# Altium project PowerBord.PrjPCB
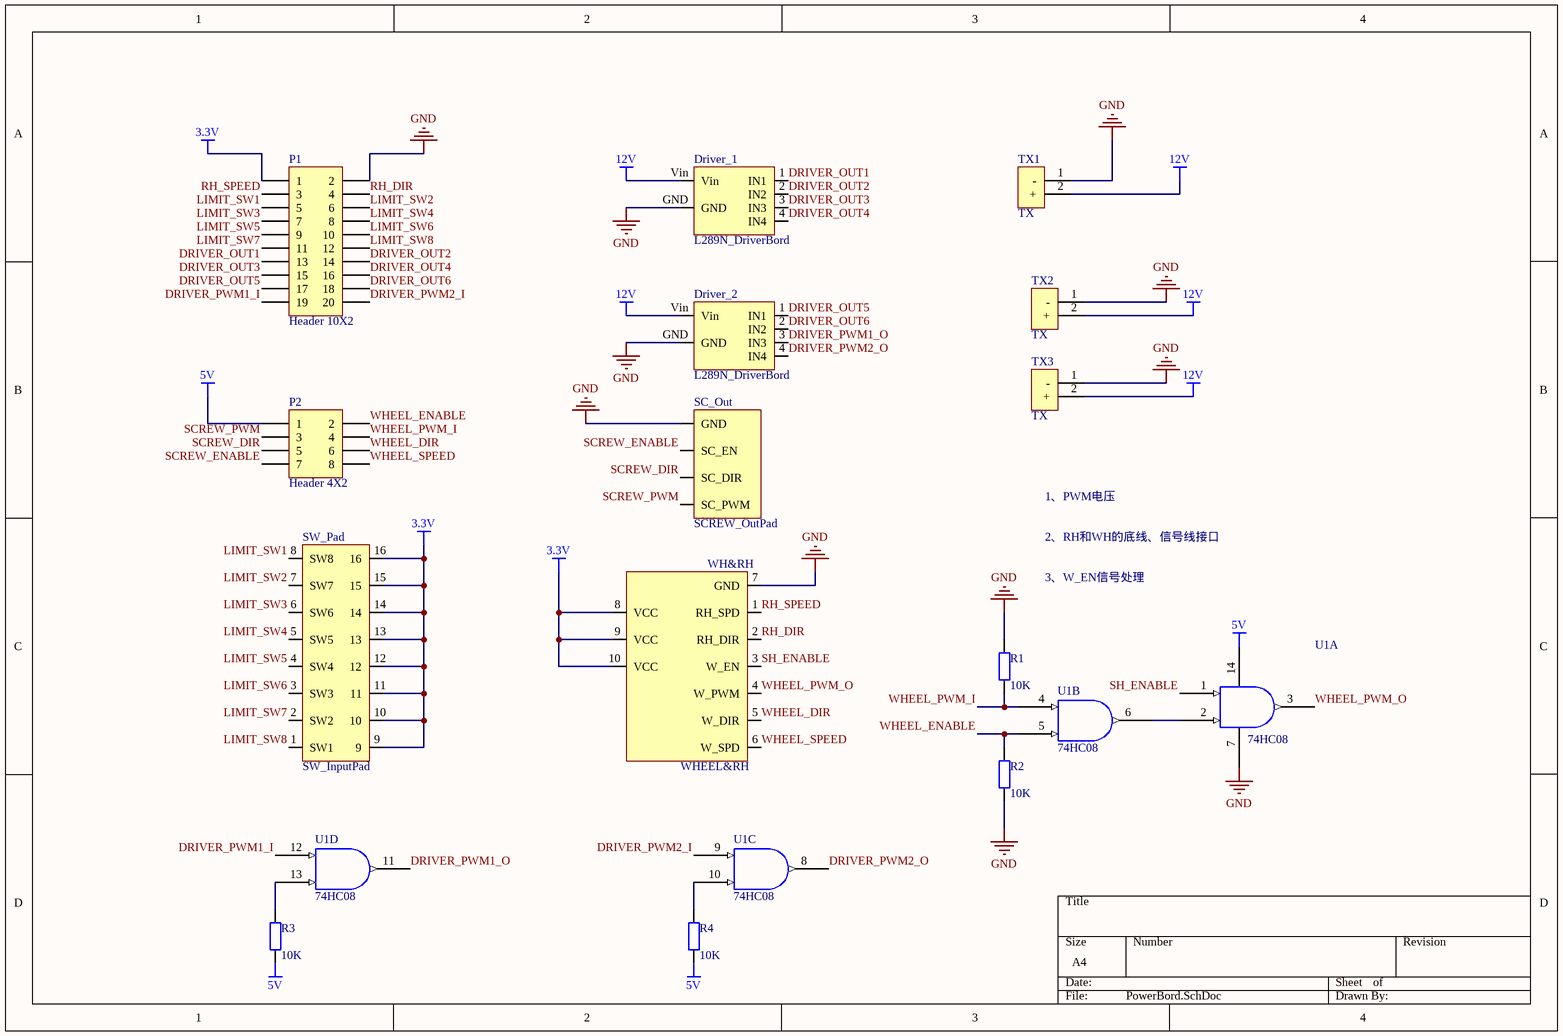
[diagram p0: PowerBord.SchDoc]
1 sheet, 15 parts. Net scope: global (net labels, ports and power ports of the same name join across sheets).
Board file: PowerBord.PcbDoc

## Sheet PowerBord.SchDoc
size A4

### Parts
Driver_1  L289N_DriverBord  [L298N_DB]
Driver_2  L289N_DriverBord  [L298N_DB]
P1  Header 10X2  [JTAG20]
P2  Header 4X2  [HDR2X4]
R1  10K  [R 0805_M]
R2  10K  [R 0805_M]
R3  10K  [R 0805_M]
R4  10K  [R 0805_M]
SC_Out  SCREW_OutPad  [SC_OutPad]
SW_Pad  SW_InputPad  [SW_InputPad]
TX1  TX  [TX]
TX2  TX  [TX]
TX3  TX  [TX]
U1  74HC08  [SOP-14]  (parts A,B,C,D of 4)
WH&RH  WHEEL&RH  [WHEEL&RH]

### Nets
3.3V: P1.1 SW_Pad.9 SW_Pad.10 SW_Pad.11 SW_Pad.12 SW_Pad.13 SW_Pad.14 SW_Pad.15 SW_Pad.16 WH&RH.8(VCC) WH&RH.9(VCC) WH&RH.10(VCC)
5V: P2.1 R3.1 R4.1 U1.14(VCC)
12V: Driver_1.Vin Driver_2.Vin TX1.2(+) TX2.2(+) TX3.2(+)
GND: Driver_1.GND Driver_2.GND P1.2 R1.2 R2.1 SC_Out.4(GND) TX1.1(-) TX2.1(-) TX3.1(-) U1.7(GND) WH&RH.7(GND)
DRIVER_OUT1: Driver_1.1(IN1) P1.13
DRIVER_OUT2: Driver_1.2(IN2) P1.14
DRIVER_OUT3: Driver_1.3(IN3) P1.15
DRIVER_OUT4: Driver_1.4(IN4) P1.16
DRIVER_OUT5: Driver_2.1(IN1) P1.17
DRIVER_OUT6: Driver_2.2(IN2) P1.18
DRIVER_PWM1_I: P1.19 U1.12
DRIVER_PWM1_O: Driver_2.3(IN3) U1.11
DRIVER_PWM2_I: P1.20 U1.9
DRIVER_PWM2_O: Driver_2.4(IN4) U1.8
LIMIT_SW1: P1.5 SW_Pad.8(SW8)
LIMIT_SW2: P1.6 SW_Pad.7(SW7)
LIMIT_SW3: P1.7 SW_Pad.6(SW6)
LIMIT_SW4: P1.8 SW_Pad.5(SW5)
LIMIT_SW5: P1.9 SW_Pad.4(SW4)
LIMIT_SW6: P1.10 SW_Pad.3(SW3)
LIMIT_SW7: P1.11 SW_Pad.2(SW2)
LIMIT_SW8: P1.12 SW_Pad.1(SW1)
RH_DIR: P1.4 WH&RH.2(RH_DIR)
RH_SPEED: P1.3 WH&RH.1(RH_SPD)
SCREW_DIR: P2.5 SC_Out.2(SC_DIR)
SCREW_ENABLE: P2.7 SC_Out.3(SC_EN)
SCREW_PWM: P2.3 SC_Out.1(SC_PWM)
SH_ENABLE: U1.1 WH&RH.3(W_EN)
WHEEL_DIR: P2.6 WH&RH.5(W_DIR)
WHEEL_ENABLE: P2.2 R2.2 U1.5
WHEEL_PWM_I: P2.4 R1.1 U1.4
WHEEL_PWM_O: U1.3 WH&RH.4(W_PWM)
WHEEL_SPEED: P2.8 WH&RH.6(W_SPD)
NetR3_2: R3.2 U1.13
NetR4_2: R4.2 U1.10
NetU1_2: U1.2 U1.6

### Notes on the sheet
- 1、PWM电压
- 2、RH和WH的底线、信号线接口
- 3、W_EN信号处理

### Library data of the parts
P1 = Header 10X2: Header, 10-Pin, Dual row; LatestRevisionDate: 17-Jul-2002; LatestRevisionNote: Re-released for DXP Platform.; Publisher: Altium Limited
P2 = Header 4X2: Header, 4-Pin, Dual row; LatestRevisionDate: 17-Jul-2002; LatestRevisionNote: Re-released for DXP Platform.; Publisher: Altium Limited
R1-R4 = Res2: Resistor; Published: 8-Jun-2000; LatestRevisionDate: 17-Jul-2002; LatestRevisionNote: Re-released for DXP Platform.; PackageReference: AXIAL-0.4; Publisher: Altium Limited; PackageDescription: Axial Device, Thru-Hole; 2 Leads; 0.4 in Pin Spacing; Value: 10K
TX1-TX3 = T型插头